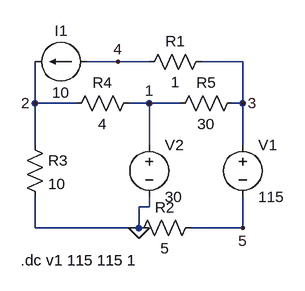
[diagram p0: schematic Draft4.asc]
Draft4.asc, the LTspice schematic file:
Version 4
SHEET 1 880 680
WIRE 208 48 160 48
WIRE 256 48 208 48
WIRE 400 48 336 48
WIRE 80 112 80 48
WIRE 144 112 80 112
WIRE 256 112 224 112
WIRE 304 112 256 112
WIRE 400 112 400 48
WIRE 400 112 384 112
WIRE 80 176 80 112
WIRE 256 176 256 112
WIRE 400 176 400 112
WIRE 256 272 256 256
WIRE 256 272 240 272
WIRE 80 304 80 256
WIRE 240 304 240 272
WIRE 240 304 80 304
WIRE 400 304 400 256
WIRE 400 304 320 304
FLAG 240 304 0
FLAG 256 112 1
FLAG 80 112 2
FLAG 400 112 3
FLAG 208 48 4
FLAG 400 304 5
SYMBOL res 352 32 R90
WINDOW 0 0 56 VBottom 2
WINDOW 3 32 56 VTop 2
SYMATTR InstName R1
SYMATTR Value 1
SYMBOL res 336 288 R90
WINDOW 0 0 56 VBottom 2
WINDOW 3 32 56 VTop 2
SYMATTR InstName R2
SYMATTR Value 5
SYMBOL res 128 128 R270
WINDOW 0 32 56 VTop 2
WINDOW 3 0 56 VBottom 2
SYMATTR InstName R4
SYMATTR Value 4
SYMBOL res 288 128 R270
WINDOW 0 32 56 VTop 2
WINDOW 3 0 56 VBottom 2
SYMATTR InstName R5
SYMATTR Value 30
SYMBOL voltage 400 160 R0
WINDOW 123 0 0 Left 0
WINDOW 39 0 0 Left 0
SYMATTR InstName V1
SYMATTR Value 115
SYMBOL voltage 256 160 R0
WINDOW 123 0 0 Left 0
WINDOW 39 0 0 Left 0
SYMATTR InstName V2
SYMATTR Value 30
SYMBOL current 160 48 R90
WINDOW 0 -32 40 VBottom 2
WINDOW 3 32 40 VTop 2
WINDOW 123 0 0 Left 0
WINDOW 39 0 0 Left 0
SYMATTR InstName I1
SYMATTR Value 10
SYMBOL res 64 160 R0
SYMATTR InstName R3
SYMATTR Value 10
TEXT 58 354 Left 2 !.dc v1 115 115 1

The netlist it stands for:
* Draft4.asc
R1 3 4 1
R2 5 0 5
R4 2 1 4
R5 1 3 30
V1 3 5 115
V2 1 0 30
I1 4 2 10
R3 2 0 10
.dc v1 115 115 1
.backanno
.end

* Results of the author's LTspice run, read from the files saved beside the schematic
* DC transfer characteristic:
*   v1 = 115 
*   V(3) = 60 V
*   V(4) = 50 V
*   V(5) = -55 V
*   V(2) = 50 V
*   V(1) = 30 V
*   I(I1) = 10 A
*   I(R3) = 5 A
*   I(R5) = -1 A
*   I(R4) = 5 A
*   I(R2) = -11 A
*   I(R1) = 10 A
*   I(V2) = 6 A
*   I(V1) = -11 A